# Altium project LASER_DRIVER_LN_HP.PrjPcb (part 3 of 4)

## Sheet Diagnostics.SchDoc: AI ARTIQ Driver
size 420 x 297 mm; Author: G.Kasprowicz; CompanyName: CTI; Organization: CTI; Address1: CTI; Address2: Nowowiejska 15/19 00-665 Warsaw; Address3: gkasprow@gmail.com; DocumentNumber: 6; Revision: 1.0; SheetNumber: 6; SheetTotal: 11; ModifiedBy: -; CheckedDate: -; Title2: protection; DivGrp: CTI; ModifiedDate: -; ProjectName: Sensor Box
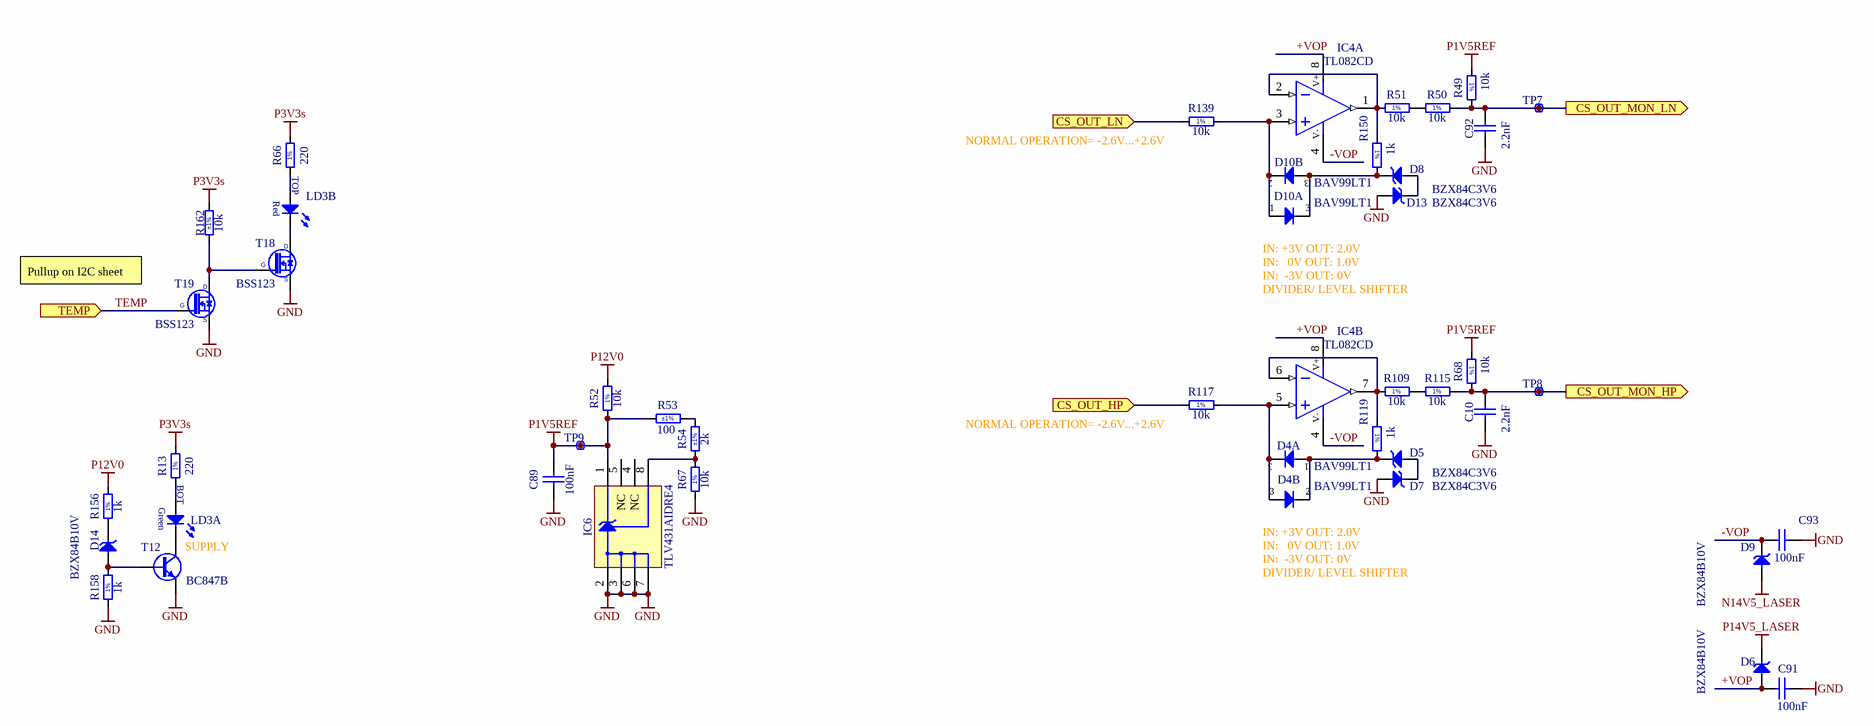
[diagram p6: Diagnostics.SchDoc]

### Parts
C10  2.2nF  [CAPC1608X87N]
C89  100nF  [CAPC1608X87N]
C91  100nF  [CAPC1608X87N]
C92  2.2nF  [CAPC1608X87N]
C93  100nF  [CAPC1608X87N]
D4  BAV99LT1  [SOT95P240X110-3N]  (parts A,B of 2)
D5  BZX84C3V6  [SOT95P240X130-3N]
D6  BZX84B10V  [SOT95P248X115-3N]
D7  BZX84C3V6  [SOT95P240X130-3N]
D8  BZX84C3V6  [SOT95P240X130-3N]
D9  BZX84B10V  [SOT95P248X115-3N]
D10  BAV99LT1  [SOT95P240X110-3N]  (parts A,B of 2)
D13  BZX84C3V6  [SOT95P240X130-3N]
D14  BZX84B10V  [SOT95P248X115-3N]
IC4  TL082CD  [SOIC127P600X175-8N]  (parts A,B of 2)
IC6  TLV431AIDRE4  [SOIC127P600X175-8N]
LD3  Red/Green  [LED_DIALIGHT_571-0112F]  (value not drawn)  (parts A,B of 2)
R13  220  [RESC1608X55N]
R49  10k  [RESC1608X55N]
R50  10k  [RESC1608X55N]
R51  10k  [RESC1608X55N]
R52  10k  [RESC1608X55N]
R53  100  Tolerance: ±1%  [RESC1608X55N]
R54  2k  Tolerance: ±1%  [RESC1608X55N]
R66  220  [RESC1608X55N]
R67  10k  [RESC1608X55N]
R68  10k  [RESC1608X55N]
R109  10k  [RESC1608X55N]
R115  10k  [RESC1608X55N]
R117  10k  [RESC1608X55N]
R119  1k  [RESC1608X55N]
R139  10k  [RESC1608X55N]
R150  1k  [RESC1608X55N]
R156  1k  [RESC1608X55N]
R158  1k  [RESC1608X55N]
R162  10k  Tolerance: ±1%  [RESC1005X40N]
T12  BC847B  [SOT95P230X110-3N]
T18  BSS123  [SOT95P240X130-3N]
T19  BSS123  [SOT95P240X130-3N]
TP7  Test Point  [TPS127]  (value not drawn)  (no BOM)
TP8  Test Point  [TPS127]  (value not drawn)  (no BOM)
TP9  Test Point  [TPS127]  (value not drawn)  (no BOM)

### Ports
CS_OUT_HP (in), CS_OUT_LN (in), CS_OUT_MON_HP (out), CS_OUT_MON_LN (out), TEMP (in)

### Nets
GND: C10.1 C89.1 C91.2 C92.1 C93.2 D7.1(A) D13.1(A) IC6.2(A) IC6.3(A) IC6.6(A) IC6.7(A) R67.1 R158.1 T12.2(E) T18.2(S) T19.2(S)
N14V5_LASER: D9.1(A)
P1V5REF: C89.2 IC6.1(C) R49.1 R52.1 R53.2 R68.1 TP9.1
P3V3s: R13.2 R66.2 R162.2
P12V0: R52.2 R156.2
P14V5_LASER: D6.3(C)
+VOP: C91.1 D6.1(A) IC4.8(V+)
-VOP: C93.1 D9.3(C) IC4.4(V-)
CS_OUT: R117.1 ; port CS_OUT_HP
CS_OUT: R139.1 ; port CS_OUT_LN  [a separate net that carries the same name]
JADC1_IN2_P: C92.2 R49.2 R50.2 TP7.1 ; port CS_OUT_MON_LN
JADC3_IN5_P: C10.2 R68.2 R115.2 TP8.1 ; port CS_OUT_MON_HP
TEMP: T19.1(G) ; port TEMP
NetD4_1: D4.1(A) D4.2(C) D5.3(C) R119.2
NetD4_3: D4.3(COMAC) IC4.5(IN+) R117.2
NetD5_1: D5.1(A) D7.3(C)
NetD8_1: D8.1(A) D13.3(C)
NetD8_3: D8.3(C) D10.3(COMAC) R150.2
NetD10_1: D10.1(A) D10.2(C) IC4.3(IN+) R139.2
NetD14_1: D14.1(A) R158.2 T12.1(B)
NetD14_3: D14.3(C) R156.1
NetIC4_1: IC4.1(OUT) IC4.2(IN-) R51.1 R150.1
NetIC4_6: IC4.6(IN-) IC4.7(OUT) R109.1 R119.1
NetIC6_8: IC6.8(REF) R54.1 R67.2
NetLD3_1: LD3.1(C) T12.3(C)
NetLD3_2: LD3.2(A) R13.1
NetLD3_3: LD3.3(C) T18.3(D)
NetLD3_4: LD3.4(A) R66.1
NetR50_1: R50.1 R51.2
NetR53_1: R53.1 R54.2
NetR109_2: R109.2 R115.1
NetR162_1: R162.1 T18.1(G) T19.3(D)

Not connected (* = marked no-connect by the designer): IC6 4(NC) 5(NC)

### Notes on the sheet
- (near R139) NORMAL OPERATION= -2.6V...+2.6V
- Pullup on I2C sheet
- IN:  -3V OUT: 0V
- (near D10) IN: +3V OUT: 2.0V
- IN:   0V OUT: 1.0V
- DIVIDER/ LEVEL SHIFTER
- (near R117) NORMAL OPERATION= -2.6V...+2.6V
- SUPPLY
- (near D4) IN: +3V OUT: 2.0V
- Project/Equipment
- Document
- Designer
- Drawn by
- Check.by
- Copyright 2018.
  This documentation describes Open Hardware and is licensed under the CERN OHL v.1.1. You may redistribute and modify this documentation under the terms of the CERN OHL v.1.1. (http://ohwr.org/CERNOHL). This documentation is distributed WITHOUT ANY EXPRESS OR IMPLIED WARRANTY, INCLUDING OF MERCHANTABILITY, SATISFACTORY QUALITY AND FITNESS FOR A PARTICULAR PURPOSE. Please see the CERN OHL v.1.1 for applicable conditions.
- Contact
- File
- Last Mod.
- Print Date
- Sheet
- Size
- A3
- of
- Rev
- (in symbol LED_DIALIGHT_571-0112F, part A) BOT; Green
- (in symbol LED_DIALIGHT_571-0112F, part B) TOP; Red
- (in symbol R0603_1K_1%_0.1W_100PPM) 1%
- (in symbol R0603_10K_1%_0.1W_100PPM) 1%
- (in symbol R0603_220R_1%_0.1W_100PPM) 1%

### Library data of the parts
C10 C92 = CC0603_2.2NF_50V_5%_C0G: Non-polarised capacitor; Part Description: SMD Multilayer Chip Ceramic Capacitor; Manufacturer: GENERIC; Manufacturer1 Part Number: C1608C0G1H222J080AA; Voltage: 50V; TC: C0G/NP0; Tolerance: ±5%; Part Number: CC0603_2.2NF_50V_5%_C0G; Component Kind: Standard; Component Type: Standard; Pin Count: 2; Value: 2.2nF; Status: Preferred; Manufacturer Part Number: CC0603_2.2NF_50V_5%_C0G; Case: 0603; Mounted: Yes; Socket: No; SMD: Yes; Sense: No; Manufacturer1 Example: TDK; Manufacturer1 ComponentHeight: 0.9mm; HelpURL: \\cern.ch\dfs\Applications\Altium\Datasheets\CC0603_C0G_TDK_C.pdf; Author: CERN DEM JMW; CreateDate: 23.06.2014; LatestRevisionDate: 23.06.2014
C89 C91 C93 = CC0603_100NF_50V_10%_X7R: Non-polarised capacitor; Part Description: SMD Multilayer Chip Ceramic Capacitor; Manufacturer: GENERIC; Manufacturer1 Part Number: 223858615649; Voltage: 50V; TC: X7R; Tolerance: ±10%; Part Number: CC0603_100NF_50V_10%_X7R; Component Kind: Standard; Component Type: Standard; Pin Count: 2; Value: 100nF; Status: Preferred; Manufacturer Part Number: CC0603_100NF_50V_10%_X7R; Case: 0603; Mounted: Yes; Socket: No; SMD: Yes; Sense: No; Manufacturer1 Example: PHYCOMP; Manufacturer1 ComponentHeight: 0.87mm; HelpURL: \\cern.ch\dfs\Applications\Altium\Datasheets\CC0603_X7R_PHYCOMP.pdf; Author: CERN DEM JLC; CreateDate: 03.12.2007; LatestRevisionDate: 03.12.2007
D4 D10 = BAV99LT1: Serial Diode; Part Description: Dual Series Switching Diode; Manufacturer: ON SEMICONDUCTOR; Voltage: 70V; Power: 225mW; PressFit: No; Bonding: No; Part Number: BAV99LT1; Component Kind: Standard; Component Type: Standard; Device: BAV99LT1; PackageDescription: SOT, 0.95mm Pitch; 3 Pin, 1.40mm W X 3.00mm L X 1.10mm H body, IPC Medium Density; Status: Obsolete; Manufacturer Part Number: BAV99LT1; Pin Count: 3; Case: SOT23-3; Mounted: Yes; Socket: No; SMD: Yes; Sense: No; ComponentHeight: 1.11mm; HelpURL: \\cern.ch\dfs\Applications\Altium\Datasheets\BAV99LT1.pdf; Author: CERN DEM JLC; CreateDate: 12.02.2009; LatestRevisionDate: 12.02.2009
D5 D7 D8 D13 = BZX84C3V6: Diode Zener Anode Pin 1 Cathode Pin 3 (Pas de pin 2); Part Description: Zener Diode; Manufacturer: FAIRCHILD SEMICONDUCTOR; Voltage: 3V6; Power: 350mW; PressFit: No; Bonding: No; Part Number: BZX84C3V6; Component Kind: Standard; Component Type: Standard; Device: BZX84C3V6; PackageDescription: SOT, 0.95mm Pitch; 3 Pin, 1.30mm W X 2.90mm L X 1.30mm H body, IPC Medium Density; Manufacturer Part Number: BZX84C3V6; Pin Count: 3; Case: SOT23-3; Mounted: Yes; Socket: No; SMD: Yes; Sense: No; ComponentHeight: 1.3mm; HelpURL: \\cern.ch\dfs\Applications\Altium\Datasheets\BZX84C3V6.pdf; Author: CERN DEM JLC; CreateDate: 06.10.2016; LatestRevisionDate: 06.10.2016
D6 D9 D14 = BZX84B10V: Diode Zener Anode Pin 1 Cathode Pin 3 (Pas de pin 2); Part Description: Small Signal Zener Diode; Manufacturer: VISHAY SEMICONDUCTORS; Voltage: 10V; Power: 300mW; PressFit: No; Bonding: No; Part Number: BZX84B10V; Component Kind: Standard; Component Type: Standard; Device: BZX84B10V; PackageDescription: SOT, 0.95mm Pitch; 3 Pin, 1.315mm W X 2.95mm L X 1.15mm H body, IPC Medium Density; Manufacturer Part Number: BZX84B10V; Pin Count: 2; Case: SOT23-3; Mounted: Yes; Socket: No; SMD: Yes; Sense: No; ComponentHeight: 1.15mm; HelpURL: \\cern.ch\dfs\Applications\Altium\Datasheets\BZX84B10V.pdf; Author: CERN DEM JLC; CreateDate: 23.10.2013; LatestRevisionDate: 23.10.2013
IC4 = TL082CD: Dual Operational Amplifier; Part Description: Dual JFET-Input Operational Amplifier; Manufacturer: TEXAS INSTRUMENTS; PressFit: No; Bonding: No; Part Number: TL082CD; Component Kind: Standard; Component Type: Standard; Device: TL082CD; PackageDescription: SOIC 8, Pitch 1.27mm - Body 4x5mm, IPC Medium Density; Manufacturer Part Number: TL082CD; Pin Count: 8; Case: SOIC8; Mounted: Yes; Socket: No; SMD: Yes; Sense: No; ComponentHeight: 1.75mm; Author: CERN DEM JLC; HelpURL: \\cern.ch\dfs\Applications\Altium\Datasheets\TL082CD.pdf; CreateDate: 20.05.2010; LatestRevisionDate: 20.05.2010
IC6 = TL431CD: Precision Programmable Reference; Part Description: Vref (1.25V) To 36V 2% Precision Programmable Reference; Manufacturer: TEXAS INSTRUMENTS; PressFit: No; Bonding: No; Part Number: TLV431AIDRE4; Component Kind: Standard; Component Type: Standard; Device: TLV431AIDRE4; PackageDescription: SOIC 8, Pitch 1.27mm, Body 4x5mm, IPC Medium Density; Manufacturer Part Number: TLV431AIDRE4; Pin Count: 8; Case: SOIC8; Mounted: Yes; Socket: No; SMD: Yes; Sense: No; ComponentHeight: 1.75mm; HelpURL: \\cern.ch\dfs\Applications\Altium\Datasheets\TL431CD.pdf; Author: CERN DEM JLC; CreateDate: 18.01.2011; LatestRevisionDate: 28.02.2011
LD3 = LED_DIALIGHT_571-0112F: 2x LED  Botom Green, Top Red; Part Description: Dual 2mm  LEDs, Red Top,Green Bot, CBI® Circuit Board Indicator (Without positioning pins); PressFit: No; Bonding: No; Part Number: LED_DIALIGHT_571-0112F; Component Kind: Standard; Component Type: Standard; Color: Red/Green; PackageDescription: 2x 2mm LED (Top: Red, Bot: Green) PCB Edge Mounting (Without positioning pins) DIALIGHT 571 Serie; Manufacturer: DIALIGHT; Manufacturer Part Number: 571-0112F; Pin Count: 4; Mounted: Yes; Socket: No; SMD: No; Sense: No; ComponentHeight: 8.6mm; HelpURL: \\cern.ch\dfs\Applications\Altium\Datasheets\LED_DIALIGHT_571-0112F.pdf; Author: CERN DEM JLC; CreateDate: 09/11/2009; LatestRevisionDate: 17/03/2010
R13 R66 = R0603_220R_1%_0.1W_100PPM: Resistor - 1%; Part Description: General Purpose Thick Film Chip Resistor; Manufacturer: GENERIC; Manufacturer1 Part Number: NRC06F2200TRF; Power: 0.1W; TC: ±100ppm/°C; Part Number: R0603_220R_1%_0.1W_100PPM; Component Kind: Standard; Component Type: Standard; Pin Count: 2; Value: 220; Status: Preferred; Tolerance: ±1%; Manufacturer Part Number: R0603_220R_1%_0.1W_100PPM; Case: 0603; Mounted: Yes; Sense: No; Socket: No; SMD: Yes; Manufacturer1 Example: NIC COMPONENT; Manufacturer1 ComponentHeight: 0.55mm; HelpURL: \\cern.ch\dfs\Applications\Altium\Datasheets\R0603_NIC_NRC.pdf; Author: CERN DEM JLC; CreateDate: 03.12.2007; LatestRevisionDate: 13.03.2008
R49-R52 R67 R68 R109 R115 R117 R139 = R0603_10K_1%_0.1W_100PPM: Resistor - 1%; Part Description: General Purpose Thick Film Chip Resistor; Manufacturer: GENERIC; Manufacturer1 Part Number: NRC06F1002TRF; Power: 0.1W; TC: ±100ppm/°C; PressFit: No; Part Number: R0603_10K_1%_0.1W_100PPM; Component Kind: Standard; Component Type: Standard; Pin Count: 2; Value: 10k; Status: Preferred; Tolerance: ±1%; Manufacturer Part Number: R0603_10K_1%_0.1W_100PPM; Case: 0603; Mounted: Yes; Sense: No; Socket: No; SMD: Yes; Manufacturer1 Example: NIC COMPONENT; Manufacturer1 ComponentHeight: 0.55mm; HelpURL: \\cern.ch\dfs\Applications\Altium\Datasheets\R0603_NIC_NRC.pdf; Author: CERN DEM JLC; CreateDate: 03.12.2007; LatestRevisionDate: 13.03.2008
R53 = R0603_100R_1%_0.1W_100PPM: Resistor - 1%; Part Description: General Purpose Thick Film Chip Resistor; Manufacturer: GENERIC; Manufacturer1 Part Number: NRC06F4700TRF; Power: 0.1W; TC: ±100ppm/°C; PressFit: No; Part Number: R0603_100R_1%_0.1W_100PPM; Component Kind: Standard; Component Type: Standard; Pin Count: 2; Value: 100; Status: Preferred; Manufacturer Part Number: R0603_100R_1%_0.1W_100PPM; Case: 0603; Mounted: Yes; Sense: No; Socket: No; SMD: Yes; Manufacturer1 Example: NIC COMPONENT; Manufacturer1 ComponentHeight: 0.55mm; HelpURL: \\cern.ch\dfs\Applications\Altium\Datasheets\R0603_NIC_NRC.pdf; Author: CERN DEM JLC; CreateDate: 03.12.2007; LatestRevisionDate: 13.03.2008
R54 = R0603_2K_1%_0.1W_100PPM: Resistor - 1%; Part Description: General Purpose Thick Film Chip Resistor; Manufacturer: GENERIC; Manufacturer1 Part Number: NRC06F2001TRF; Power: 0.1W; TC: ±100ppm/°C; PressFit: No; Part Number: R0603_2K_1%_0.1W_100PPM; Component Kind: Standard; Component Type: Standard; Pin Count: 2; Value: 2k; Status: Preferred; Manufacturer Part Number: R0603_2K_1%_0.1W_100PPM; Case: 0603; Mounted: Yes; Sense: No; Socket: No; SMD: Yes; Manufacturer1 Example: NIC COMPONENT; Manufacturer1 ComponentHeight: 0.55mm; HelpURL: \\cern.ch\dfs\Applications\Altium\Datasheets\R0603_NIC_NRC.pdf; Author: CERN DEM JLC; CreateDate: 03.12.2007; LatestRevisionDate: 13.03.2008
R119 R150 R156 R158 = R0603_1K_1%_0.1W_100PPM: Resistor - 1%; Part Description: General Purpose Thick Film Chip Resistor; Manufacturer: GENERIC; Manufacturer1 Part Number: NRC06F1001TRF; Power: 0.1W; TC: ±100ppm/°C; PressFit: No; Part Number: R0603_1K_1%_0.1W_100PPM; Component Kind: Standard; Component Type: Standard; Pin Count: 2; Value: 1k; Status: Preferred; Tolerance: ±1%; Manufacturer Part Number: R0603_1K_1%_0.1W_100PPM; Case: 0603; Mounted: Yes; Sense: No; Socket: No; SMD: Yes; Manufacturer1 Example: NIC COMPONENT; Manufacturer1 ComponentHeight: 0.55mm; HelpURL: \\cern.ch\dfs\Applications\Altium\Datasheets\R0603_NIC_NRC.pdf; Author: CERN DEM JLC; CreateDate: 03.12.2007; LatestRevisionDate: 13.03.2008
R162 = R0402_10K_1%_0.0625W_100PPM: Resistor - 1%; Part Description: General Purpose Thick Film Chip Resistor; Manufacturer: GENERIC; Manufacturer1 Part Number: 232270671003L; TC: ±100ppm/°C; PressFit: No; Part Number: R0402_10K_1%_0.0625W_100PPM; Component Kind: Standard; Component Type: Standard; Pin Count: 2; Value: 10k; Status: Not Recommended; Power: 0.0625W; Manufacturer Part Number: R0402_10K_1%_0.0625W_100PPM; Case: 0402; Mounted: Yes; Sense: No; Socket: No; SMD: Yes; Manufacturer1 Example: YAGEO PHYCOMP; Manufacturer1 ComponentHeight: 0.4mm; HelpURL: \\cern.ch\dfs\Applications\Altium\Datasheets\R0402_Phycomp_RC0402.pdf; Author: CERN DEM JLC; CreateDate: 03.12.2007; LatestRevisionDate: 17.10.2012
T12 = BC847B: NPN Transistor; Part Description: 45V 100mA NPN general-purpose transistors; Manufacturer: NXP SEMICONDUCTORS; PressFit: No; Bonding: No; Part Number: BC847B; Component Kind: Standard; Component Type: Standard; Device: BC847B; PackageDescription: SOT23, 0.95mm Pitch; 3 Pin, 1.30mm W X 2.90mm L X 1.10mm H body, IPC Medium Density; Manufacturer Part Number: BC847B; Pin Count: 3; Case: SOT23-3; Mounted: Yes; Socket: No; SMD: Yes; Sense: No; ComponentHeight: 1.1mm; HelpURL: \\cern.ch\dfs\Applications\Altium\Datasheets\BC847B.pdf; Author: CERN DEM JLC; CreateDate: 14.06.2011; LatestRevisionDate: 14.06.2011
T18 T19 = BSS123: N-CHANNEL MOSFET WITH DIODE; Part Description: 100V 170mA N-Channel Logic Level Enhancement Mode Field Effect Transistor (FET); Manufacturer: FAIRCHILD SEMICONDUCTOR; PressFit: No; Bonding: No; Part Number: BSS123; Component Kind: Standard; Component Type: Standard; Device: BSS123; PackageDescription: SOT23, 0.95mm Pitch; 3 Pin, 1.30mm W X 2.90mm L X 1.30mm H body, IPC Medium Density; Manufacturer Part Number: BSS123; Pin Count: 3; Case: SOT23-3; Mounted: Yes; Socket: No; SMD: Yes; Sense: No; ComponentHeight: 1.3mm; HelpURL: \\cern.ch\dfs\Applications\Altium\Datasheets\BSS123.pdf; Author: CERN DEM JLC; CreateDate: 07.04.2009; LatestRevisionDate: 07.04.2009
TP7-TP9 = SMD_PAD_1.27X1.27MM: Part Description: 1.27mm x 1.27mm PCB Copper Area (SMD Test Point); Mounted: No; Part Number: SMD_PAD_1.27X1.27MM; Component Type: Standard (No BOM); Pin Count: 1; Family: Test Point; Socket: No; SMD: No; Sense: No; Status: None; ComponentHeight: 0mm; HelpURL: Undefined; Author: CERN DEM JLC; CreateDate: 12.01.2008; LatestRevisionDate: 12.01.2008; PackageDescription: 1.27mm x 1.27mm PCB Copper Area (SMD Test Point)

## Sheet LN_LASER_PS.SchDoc: AI ARTIQ Driver
size 420 x 297 mm; Author: G.Kasprowicz; CompanyName: CTI; Organization: CTI; Address1: CTI; Address2: Nowowiejska 15/19 00-665 Warsaw; Address3: gkasprow@gmail.com; DocumentNumber: 9; Revision: 1.0; SheetNumber: 9; SheetTotal: 11; ModifiedBy: -; CheckedDate: -; Title2: LN LASER PS; DivGrp: CTI; ModifiedDate: -; ProjectName: Sensor Box
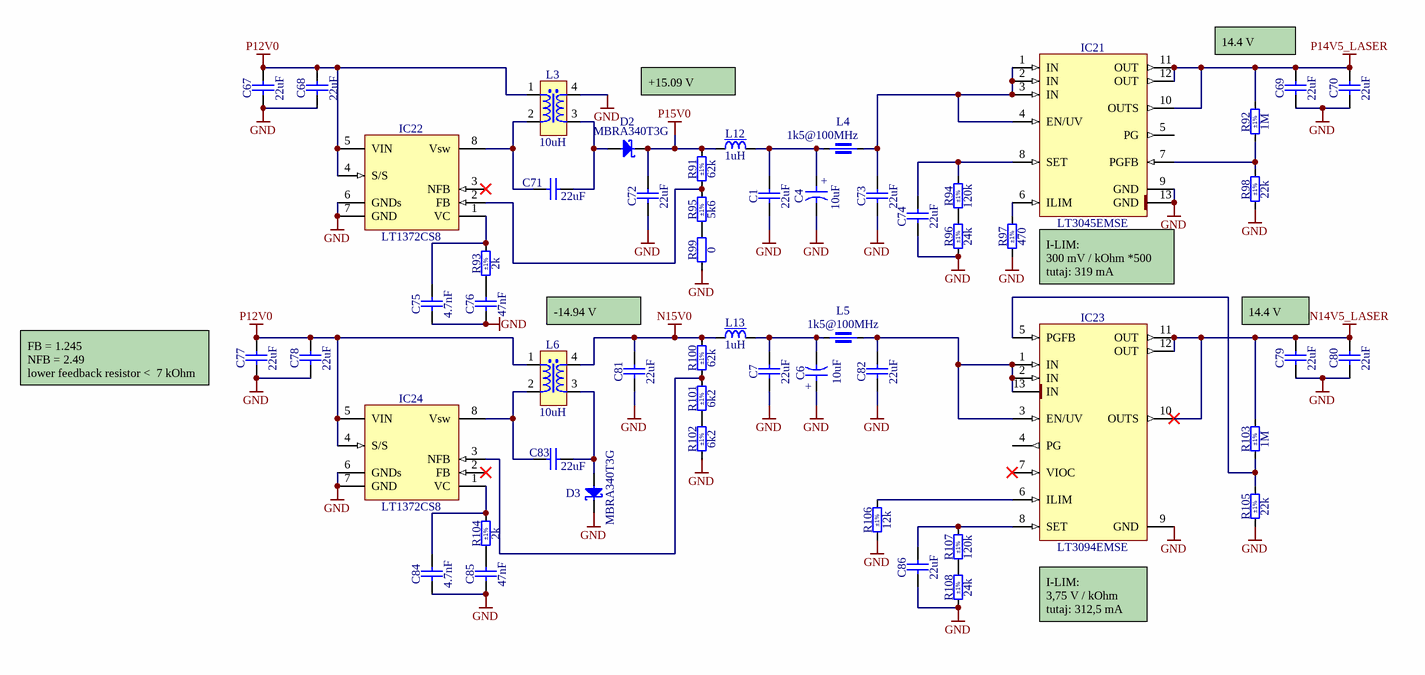
[diagram p7: LN_LASER_PS.SchDoc]

### Parts
C1  22uF  [CAPC3216X180N]
C4  10uF  [CAPMP3528X210N]
C6  10uF  [CAPMP3528X210N]
C7  22uF  [CAPC3216X180N]
C67  22uF  [CAPC3216X180N]
C68  22uF  [CAPC3216X180N]
C69  22uF  [CAPC3216X180N]
C70  22uF  [CAPC3216X180N]
C71  22uF  [CAPC3216X180N]
C72  22uF  [CAPC3216X180N]
C73  22uF  [CAPC3216X180N]
C74  22uF  [CAPC3216X180N]
C75  4.7nF  [CAPC1005X55N]
C76  47nF  [CAPC1005X55N]
C77  22uF  [CAPC3216X180N]
C78  22uF  [CAPC3216X180N]
C79  22uF  [CAPC3216X180N]
C80  22uF  [CAPC3216X180N]
C81  22uF  [CAPC3216X180N]
C82  22uF  [CAPC3216X180N]
C83  22uF  [CAPC3216X180N]
C84  4.7nF  [CAPC1005X55N]
C85  47nF  [CAPC1005X55N]
C86  22uF  [CAPC3216X180N]
D2  MBRA340T3G  [DIOM5226X220N]
D3  MBRA340T3G  [DIOM5226X220N]
IC21  LT3045EMSE  [SOP65P490X110-13N-R175X294]
IC22  LT1372CS8  [SOIC127P600X175-8N]
IC23  LT3094EMSE  [SOP65P490X110-13N-R175X294]
IC24  LT1372CS8  [SOIC127P600X175-8N]
L3  10uH  [IND_COOPER_CTX-1A]
L4  1k5@100MHz  [INDC2012X110N]
L5  1k5@100MHz  [INDC2012X110N]
L6  10uH  [IND_COOPER_CTX-1A]
L12  1uH  [INDM3225X210N]
L13  1uH  [INDM3225X210N]
R91  62k  Tolerance: ±1%  [RESC1005X40N]
R92  1M  Tolerance: ±1%  [RESC1005X40N]
R93  2k  Tolerance: ±1%  [RESC1005X40N]
R94  120k  Tolerance: ±1%  [RESC1608X55N]
R95  5k6  Tolerance: ±1%  [RESC1005X40N]
R96  24k  Tolerance: ±1%  [RESC1608X55N]
R97  470  Tolerance: ±1%  [RESC1005X40N]
R98  22k  Tolerance: ±1%  [RESC1005X40N]
R99  0  [RESC1005X40N]
R100  62k  Tolerance: ±1%  [RESC1005X40N]
R101  6k2  Tolerance: ±1%  [RESC1005X40N]
R102  6k2  Tolerance: ±1%  [RESC1005X40N]
R103  1M  Tolerance: ±1%  [RESC1005X40N]
R104  2k  Tolerance: ±1%  [RESC1005X40N]
R105  22k  Tolerance: ±1%  [RESC1005X40N]
R106  12k  Tolerance: ±1%  [RESC1005X40N]
R107  120k  Tolerance: ±1%  [RESC1608X55N]
R108  24k  Tolerance: ±1%  [RESC1608X55N]

### Nets
GND: C1.1 C4.2 C6.1 C7.1 C67.1 C68.1 C69.1 C70.1 C72.1 C73.1 C74.1 C75.1 C76.1 C77.1 C78.1 C79.1 C80.1 C81.1 C82.1 C84.1 C85.1 C86.1 D3.1(C) IC21.9(GND) IC21.13(GND) IC22.6(GNDs) IC22.7(GND) IC23.9(GND) IC24.6(GNDs) IC24.7(GND) L3.4 R96.1 R97.1 R98.1 R99.1 R102.1 R105.1 R106.1 R108.1
N14V5_LASER: C79.2 C80.2 IC23.10(OUTS) IC23.11(OUT) IC23.12(OUT) R103.2
N15V0: C81.2 L6.4 L13.1 R100.2
P12V0: C67.2 C68.2 C77.2 C78.2 IC22.4(S/S) IC22.5(VIN) IC24.4(S/S) IC24.5(VIN) L3.1 L6.1
P14V5_LASER: C69.2 C70.2 IC21.10(OUTS) IC21.11(OUT) IC21.12(OUT) R92.2
P15V0: C72.2 D2.1(C) L12.1 R91.2
NetC1_2: C1.2 C4.1 L4.1 L12.2
NetC6_2: C6.2 C7.2 L5.1 L13.2
NetC71_1: C71.1 D2.2(A) L3.3
NetC71_2: C71.2 IC22.8(Vsw) L3.2
NetC73_2: C73.2 IC21.1(IN) IC21.2(IN) IC21.3(IN) IC21.4(EN/UV) L4.2
NetC74_2: C74.2 IC21.8(SET) R94.2
NetC75_2: C75.2 IC22.1(VC) R93.2
NetC76_2: C76.2 R93.1
NetC82_2: C82.2 IC23.1(IN) IC23.2(IN) IC23.3(EN/UV) IC23.13(IN) L5.2
NetC83_1: C83.1 D3.2(A) L6.3
NetC83_2: C83.2 IC24.8(Vsw) L6.2
NetC84_2: C84.2 IC24.1(VC) R104.2
NetC85_2: C85.2 R104.1
NetC86_2: C86.2 IC23.8(SET) R107.2
NetIC21_6: IC21.6(ILIM) R97.2
NetIC21_7: IC21.7(PGFB) R92.1 R98.2
NetIC22_2: IC22.2(FB) R91.1 R95.2
NetIC23_5: IC23.5(PGFB) R103.1 R105.2
NetIC23_6: IC23.6(ILIM) R106.2
NetIC24_3: IC24.3(NFB) R100.1 R101.2
NetR94_1: R94.1 R96.2
NetR95_1: R95.1 R99.2
NetR101_1: R101.1 R102.2
NetR107_1: R107.1 R108.2

Not connected (* = marked no-connect by the designer): IC21 5(PG); IC22 3(NFB)*; IC23 4(PG) 7(VIOC)*; IC24 2(FB)*

### Notes on the sheet
- +15.09 V
- (near C69) 14.4 V
- I-LIM:
  300 mV / kOhm *500
  tutaj: 319 mA
- -14.94 V
- (near C79) 14.4 V
- (near C77) FB = 1.245
  NFB = 2.49
  lower feedback resistor <  7 kOhm
- (near IC23) I-LIM:
  3,75 V / kOhm
  tutaj: 312,5 mA
- Project/Equipment
- Document
- Designer
- Drawn by
- Check.by
- Copyright 2018.
  This documentation describes Open Hardware and is licensed under the CERN OHL v.1.1. You may redistribute and modify this documentation under the terms of the CERN OHL v.1.1. (http://ohwr.org/CERNOHL). This documentation is distributed WITHOUT ANY EXPRESS OR IMPLIED WARRANTY, INCLUDING OF MERCHANTABILITY, SATISFACTORY QUALITY AND FITNESS FOR A PARTICULAR PURPOSE. Please see the CERN OHL v.1.1 for applicable conditions.
- Contact
- File
- Last Mod.
- Print Date
- Sheet
- Size
- A3
- of
- Rev
- (in symbol CTE3528-21_10UF_20V_10%_AVX_TPSB106K020T0500) +

### Library data of the parts
C1 C7 C67-C74 C77-C83 C86 = CC1206_22UF_35V_20%_JB_TDK_C3216JB1V226M160AC: Non-polarised capacitor; Part Description: SMD Multilayer Chip Ceramic Capacitor; Manufacturer: TDK; Voltage: 35V; TC: JB(±10%); Tolerance: ±20%; Part Number: CC1206_22UF_35V_20%_JB_TDK_C3216JB1V226M160AC; Component Kind: Standard; Component Type: Standard; Pin Count: 2; Value: 22uF; Status: None; Manufacturer Part Number: C3216JB1V226M160AC; Case: 1206; Mounted: Yes; Socket: No; SMD: Yes; Sense: No; ComponentHeight: 1.8mm; HelpURL: \\cern.ch\dfs\Applications\Altium\Datasheets\CC1206_TDK_C3216JB1V226M160AC.pdf; Author: CERN DEM JLC; CreateDate: 13.07.2017; LatestRevisionDate: 13.07.2017
C4 C6 = CTE3528-21_10UF_20V_10%_AVX_TPSB106K020T0500: Polarised capacitor; Part Description: Low ESR 0R5 Automotive Solid Tantalum Chip Capacitor; Manufacturer: AVX; Voltage: 20V; Tolerance: ±10%; Part Number: CTE3528-21_10UF_20V_10%_AVX_TPSB106K020T0500; Component Kind: Standard; Component Type: Standard; Pin Count: 2; Value: 10uF; Status: Not Recommended; Manufacturer Part Number: TPSB106K020T0500; Case: B; Mounted: Yes; Socket: No; SMD: Yes; Sense: No; ComponentHeight: 2.1mm; HelpURL: \\cern.ch\dfs\Applications\Altium\Datasheets\CTE-LESR_AVX_TPS-AUTO.pdf; Author: CERN DEM JLC; CreateDate: 10.05.2017; LatestRevisionDate: 10.05.2017
C75 C84 = CC0402_4.7NF_16V_10%_X7R: Non-polarised capacitor; Part Description: SMD Multilayer Chip Ceramic Capacitor; Manufacturer: GENERIC; Manufacturer1 Part Number: 223878715632; Voltage: 16V; TC: X7R; Tolerance: ±10%; Part Number: CC0402_4.7NF_16V_10%_X7R; Component Kind: Standard; Component Type: Standard; Pin Count: 2; Value: 4.7nF; Status: Not Recommended; Manufacturer Part Number: CC0402_4.7NF_16V_10%_X7R; Case: 0402; Mounted: Yes; Socket: No; SMD: Yes; Sense: No; Manufacturer1 Example: PHYCOMP; Manufacturer1 ComponentHeight: 0.55mm; HelpURL: \\cern.ch\dfs\Applications\Altium\Datasheets\CC0402_X7R_PHYCOMP.pdf; Author: CERN DEM JLC; CreateDate: 03.12.2007; LatestRevisionDate: 03.12.2007
C76 C85 = CC0402_47NF_25V_10%_X7R: Non-polarised capacitor; Part Description: SMD Multilayer Chip Ceramic Capacitor; Manufacturer: GENERIC; Manufacturer1 Part Number: C1005X7R1E473K050; Voltage: 25V; TC: X7R; Tolerance: ±10%; Part Number: CC0402_47NF_25V_10%_X7R; Component Kind: Standard; Component Type: Standard; Pin Count: 2; Value: 47nF; Status: Preferred; Manufacturer Part Number: CC0402_47NF_25V_10%_X7R; Case: 0402; Mounted: Yes; Socket: No; SMD: Yes; Sense: No; Manufacturer1 Example: TDK; Manufacturer1 ComponentHeight: 0.55mm; HelpURL: \\cern.ch\dfs\Applications\Altium\Datasheets\CC0402_X7R_TDK_C.pdf; Author: CERN DEM JLC; CreateDate: 25.10.2012; LatestRevisionDate: 25.10.2012
D2 D3 = MBRA340T3G: Schottky Diode; Part Description: Schottky Power Rectifier; Manufacturer: ON SEMICONDUCTOR; Voltage: 40V; Power: 3A; PressFit: No; Bonding: No; Part Number: MBRA340T3G; Component Kind: Standard; Component Type: Standard; Device: MBRA340T3G; PackageDescription: DO-214-AC/SMA Diode, Molded Body; 5.21mm L X 2.60mm W X 2.20mm H, IPC Medium Density; Manufacturer Part Number: MBRA340T3G; Pin Count: 2; Case: DO-214AC; Mounted: Yes; Socket: No; SMD: Yes; Sense: No; ComponentHeight: 2.20mm; HelpURL: \\cern.ch\dfs\Applications\Altium\Datasheets\MBRA340T3G.pdf; Author: CERN DEM JLC; CreateDate: 18.06.2012; LatestRevisionDate: 18.06.2012
IC21 = LT3045EMSE: 20V, 500mA, Ultralow Noise, Ultrahigh PSRR Linear Regulator; Manufacturer: LINEAR TECHNOLOGY; PressFit: No; Bonding: No; Part Number: LT3045EMSE; Component Kind: Standard; Component Type: Standard; Device: LT3045EMSE; PackageDescription: SOP, 0.65mm Pitch; 12 Pin, 3.00mm W X 4.039mm L X 1.10mm H body (w/Thermal Tab 1.75 X 2.94 mm), IPC Medium Density; Part Description: 20V, 500mA, Ultralow Noise, Ultrahigh PSRR Linear Regulator; Manufacturer Part Number: LT3045EMSE; Pin Count: 13; Case: MSOP12; Mounted: Yes; Socket: No; SMD: Yes; Sense: No; ComponentHeight: 1.1mm; HelpURL: \\cern.ch\dfs\Applications\Altium\Datasheets\LT3045.pdf; Author: CERN DEM HF; CreateDate: 18.05.2022; LatestRevisionDate: 18.05.2022
IC22 IC24 = LT1372CS8: 500kHz, 1.5A, High Efficiency, 1.5A Switching Regulators; Manufacturer: LINEAR TECHNOLOGY; PressFit: No; Bonding: No; Part Number: LT1372CS8; Component Kind: Standard; Component Type: Standard; Device: LT1372CS8; PackageDescription: SOIC 8, Pitch 1.27mm, Body 4x5mm, IPC Medium Density; Part Description: 500kHz, 1.5A,  High Efficiency, 1.5A Switching Regulators; Manufacturer Part Number: LT1372CS8; Pin Count: 8; Case: SOIC8; Mounted: Yes; Socket: No; SMD: Yes; Sense: No; ComponentHeight: 1.75mm; HelpURL: \\cern.ch\dfs\Applications\Altium\Datasheets\LT1372.pdf; Author: CERN DEM HF; CreateDate: 18.05.2022; LatestRevisionDate: 18.05.2022
IC23 = LT3094EMSE#PBF: -20V, 500mA, Ultralow Noise, Ultrahigh PSRR Negative Linear Regulator; Manufacturer: LINEAR TECHNOLOGY; PressFit: No; Bonding: No; Part Number: LT3094EMSE#PBF; Component Kind: Standard; Component Type: Standard; Device: LT3094EMSE; PackageDescription: SOP, 0.65mm Pitch; 12 Pin, 3.00mm W X 4.039mm L X 1.10mm H body (w/Thermal Tab 1.75 X 2.94 mm), IPC Medium Density; Part Description: -20V, 500mA, Ultralow Noise, Ultrahigh PSRR Negative Linear Regulator; Manufacturer Part Number: LT3094EMSE#PBF; Pin Count: 13; Case: MSOP12; Mounted: Yes; Socket: No; SMD: Yes; Sense: No; ComponentHeight: 1.1mm; HelpURL: \\cern.ch\dfs\Applications\Altium\Datasheets\LT3094EMSE#PBF.pdf; Author: CERN DEM JLC; CreateDate: 12.11.2018; LatestRevisionDate: 12.11.2018
L3 L6 = IND_COOPER_CTX10-1A-R: Dual Winding Shielded Power Inductor/Transformer CTX OCTA-PAC® PLUS Serie; Part Description: Dual Winding Shielded Power Inductor/Transformer CTX OCTA-PAC® PLUS Series; Manufacturer: COOPER BUSSMANN; Tolerance: ±25%; Part Number: IND_COOPER_CTX10-1A-R; Component Kind: Standard; Component Type: Standard; Pin Count: 2; Value: 10uH; Manufacturer Part Number: CTX10-1A-R; Mounted: Yes; Socket: No; SMD: Yes; Sense: No; ComponentHeight: 4.19mm; HelpURL: \\cern.ch\dfs\Applications\Altium\Datasheets\IND_COOPER_CTX.pdf; Author: CERN DEM JLC; CreateDate: 10.08.2010; LatestRevisionDate: 10.08.2010
L4 L5 = IND0805_WURTH_742792097: Part Description: SMD EMI Suppression Chip Ferrite Bead (WE-CBF Series); Manufacturer: WURTH ELEKTRONIK; Power: 1A; Resistance: 0.3R; Tolerance: ±25%; Part Number: IND0805_WURTH_742792097; Component Kind: Standard; Component Type: Standard; Pin Count: 2; Value: 1k5@100MHz; Manufacturer Part Number: 742792097; Case: 0805; Mounted: Yes; Socket: No; SMD: Yes; Sense: No; ComponentHeight: 1.1mm; HelpURL: \\cern.ch\dfs\Applications\Altium\Datasheets\IND0805_WURTH_742792097.pdf; Author: CERN DEM MR; CreateDate: 29.06.2017; LatestRevisionDate: 25.10.2018
L12 L13 = IND1210_1UH_10%_EPCOS_B82422A: Inductor With Core; Part Description: SMT Inductor SIMID Series; Manufacturer: EPCOS; Manufacturer Part Number: B82422A1102K100; Power: 380mA; Resistance: 0.34R; Tolerance: ±10%; Part Number: IND1210_1UH_10%_EPCOS_B82422A; Component Kind: Standard; Component Type: Standard; Pin Count: 2; Value: 1uH; Status: None; Case: 1210; Mounted: Yes; Socket: No; SMD: Yes; Sense: No; ComponentHeight: 2.1mm; HelpURL: \\cern.ch\dfs\Applications\Altium\Datasheets\IND1210_EPCOS_B82422A.pdf; Author: CERN DEM JLC; CreateDate: 30.11.2011; LatestRevisionDate: 30.11.2011
R91 R100 = R0402_62K_1%_0.0625W_100PPM: Resistor - 1%; Part Description: General Purpose Thick Film Chip Resistor; Manufacturer: GENERIC; Manufacturer1 Part Number: 232270676203L; TC: ±100ppm/°C; PressFit: No; Part Number: R0402_62K_1%_0.0625W_100PPM; Component Kind: Standard; Component Type: Standard; Pin Count: 2; Value: 62k; Status: Not Recommended; Power: 0.0625W; Manufacturer Part Number: R0402_62K_1%_0.0625W_100PPM; Case: 0402; Mounted: Yes; Sense: No; Socket: No; SMD: Yes; Manufacturer1 Example: YAGEO PHYCOMP; Manufacturer1 ComponentHeight: 0.4mm; HelpURL: \\cern.ch\dfs\Applications\Altium\Datasheets\R0402_Phycomp_RC0402.pdf; Author: CERN DEM JLC; CreateDate: 03.12.2007; LatestRevisionDate: 17.10.2012
R92 R103 = R0402_1M_1%_0.0625W_100PPM: Resistor - 1%; Part Description: General Purpose Thick Film Chip Resistor; Manufacturer: GENERIC; Manufacturer1 Part Number: 232270671005L; TC: ±100ppm/°C; PressFit: No; Part Number: R0402_1M_1%_0.0625W_100PPM; Component Kind: Standard; Component Type: Standard; Pin Count: 2; Value: 1M; Status: Not Recommended; Power: 0.0625W; Manufacturer Part Number: R0402_1M_1%_0.0625W_100PPM; Case: 0402; Mounted: Yes; Sense: No; Socket: No; SMD: Yes; Manufacturer1 Example: YAGEO PHYCOMP; Manufacturer1 ComponentHeight: 0.4mm; HelpURL: \\cern.ch\dfs\Applications\Altium\Datasheets\R0402_Phycomp_RC0402.pdf; Author: CERN DEM JLC; CreateDate: 03.12.2007; LatestRevisionDate: 17.10.2012
R93 R104 = R0402_2K_1%_0.0625W_100PPM: Resistor - 1%; Part Description: General Purpose Thick Film Chip Resistor; Manufacturer: GENERIC; Manufacturer1 Part Number: 232270672002L; TC: ±100ppm/°C; PressFit: No; Part Number: R0402_2K_1%_0.0625W_100PPM; Component Kind: Standard; Component Type: Standard; Pin Count: 2; Value: 2k; Status: Not Recommended; Power: 0.0625W; Manufacturer Part Number: R0402_2K_1%_0.0625W_100PPM; Case: 0402; Mounted: Yes; Sense: No; Socket: No; SMD: Yes; Manufacturer1 Example: YAGEO PHYCOMP; Manufacturer1 ComponentHeight: 0.4mm; HelpURL: \\cern.ch\dfs\Applications\Altium\Datasheets\R0402_Phycomp_RC0402.pdf; Author: CERN DEM JLC; CreateDate: 03.12.2007; LatestRevisionDate: 17.10.2012
R94 R107 = R0603_120K_1%_0.1W_100PPM: Resistor - 1%; Part Description: General Purpose Thick Film Chip Resistor; Manufacturer: GENERIC; Manufacturer1 Part Number: NRC06F1203TRF; Power: 0.1W; TC: ±100ppm/°C; PressFit: No; Part Number: R0603_120K_1%_0.1W_100PPM; Component Kind: Standard; Component Type: Standard; Pin Count: 2; Value: 120k; Status: Preferred; Manufacturer Part Number: R0603_120K_1%_0.1W_100PPM; Case: 0603; Mounted: Yes; Sense: No; Socket: No; SMD: Yes; Manufacturer1 Example: NIC COMPONENT; Manufacturer1 ComponentHeight: 0.55mm; HelpURL: \\cern.ch\dfs\Applications\Altium\Datasheets\R0603_NIC_NRC.pdf; Author: CERN DEM JLC; CreateDate: 03.12.2007; LatestRevisionDate: 13.03.2008
R95 = R0402_5K6_1%_0.0625W_100PPM: Resistor - 1%; Part Description: General Purpose Thick Film Chip Resistor; Manufacturer: GENERIC; Manufacturer1 Part Number: 232270675602L; TC: ±100ppm/°C; PressFit: No; Part Number: R0402_5K6_1%_0.0625W_100PPM; Component Kind: Standard; Component Type: Standard; Pin Count: 2; Value: 5k6; Status: Not Recommended; Power: 0.0625W; Manufacturer Part Number: R0402_5K6_1%_0.0625W_100PPM; Case: 0402; Mounted: Yes; Sense: No; Socket: No; SMD: Yes; Manufacturer1 Example: YAGEO PHYCOMP; Manufacturer1 ComponentHeight: 0.4mm; HelpURL: \\cern.ch\dfs\Applications\Altium\Datasheets\R0402_Phycomp_RC0402.pdf; Author: CERN DEM JLC; CreateDate: 03.12.2007; LatestRevisionDate: 17.10.2012
R96 R108 = R0603_24K_1%_0.1W_100PPM: Resistor - 1%; Part Description: General Purpose Thick Film Chip Resistor; Manufacturer: GENERIC; Manufacturer1 Part Number: NRC06F2402TRF; Power: 0.1W; TC: ±100ppm/°C; PressFit: No; Part Number: R0603_24K_1%_0.1W_100PPM; Component Kind: Standard; Component Type: Standard; Pin Count: 2; Value: 24k; Status: Preferred; Manufacturer Part Number: R0603_24K_1%_0.1W_100PPM; Case: 0603; Mounted: Yes; Sense: No; Socket: No; SMD: Yes; Manufacturer1 Example: NIC COMPONENT; Manufacturer1 ComponentHeight: 0.55mm; HelpURL: \\cern.ch\dfs\Applications\Altium\Datasheets\R0603_NIC_NRC.pdf; Author: CERN DEM JLC; CreateDate: 03.12.2007; LatestRevisionDate: 13.03.2008
R97 = R0402_470R_1%_0.0625W_100PPM: Resistor - 1%; Part Description: General Purpose Thick Film Chip Resistor; Manufacturer: GENERIC; Manufacturer1 Part Number: 232270674701L; TC: ±100ppm/°C; PressFit: No; Part Number: R0402_470R_1%_0.0625W_100PPM; Component Kind: Standard; Component Type: Standard; Pin Count: 2; Value: 470; Status: Not Recommended; Power: 0.0625W; Manufacturer Part Number: R0402_470R_1%_0.0625W_100PPM; Case: 0402; Mounted: Yes; Sense: No; Socket: No; SMD: Yes; Manufacturer1 Example: YAGEO PHYCOMP; Manufacturer1 ComponentHeight: 0.4mm; HelpURL: \\cern.ch\dfs\Applications\Altium\Datasheets\R0402_Phycomp_RC0402.pdf; Author: CERN DEM JLC; CreateDate: 03.12.2007; LatestRevisionDate: 17.10.2012
R98 R105 = R0402_22K_1%_0.0625W_100PPM: Resistor - 1%; Part Description: General Purpose Thick Film Chip Resistor; Manufacturer: GENERIC; Manufacturer1 Part Number: 232270672203L; TC: ±100ppm/°C; PressFit: No; Part Number: R0402_22K_1%_0.0625W_100PPM; Component Kind: Standard; Component Type: Standard; Pin Count: 2; Value: 22k; Status: Not Recommended; Power: 0.0625W; Manufacturer Part Number: R0402_22K_1%_0.0625W_100PPM; Case: 0402; Mounted: Yes; Sense: No; Socket: No; SMD: Yes; Manufacturer1 Example: YAGEO PHYCOMP; Manufacturer1 ComponentHeight: 0.4mm; HelpURL: \\cern.ch\dfs\Applications\Altium\Datasheets\R0402_Phycomp_RC0402.pdf; Author: CERN DEM JLC; CreateDate: 03.12.2007; LatestRevisionDate: 17.10.2012
R99 = R0402_0R_JUMPER: Resistor; Part Description: 1A (0.05R Max DC Resistance) Zero Ohm Jumper; Manufacturer: GENERIC; Manufacturer1 Part Number: 232270591001L; PressFit: No; Part Number: R0402_0R_JUMPER; Component Kind: Standard; Component Type: Standard; Pin Count: 2; Value: 0; Status: Not Recommended; Manufacturer Part Number: R0402_0R_JUMPER; Case: 0402; Mounted: Yes; Sense: No; Socket: No; SMD: Yes; Manufacturer1 Example: YAGEO PHYCOMP; Manufacturer1 ComponentHeight: 0.4mm; HelpURL: \\cern.ch\dfs\Applications\Altium\Datasheets\R0402_Phycomp_RC0402.pdf; Author: CERN DEM JLC; CreateDate: 03.12.2007; LatestRevisionDate: 17.10.2012
R101 R102 = R0402_6K2_1%_0.0625W_100PPM: Resistor - 1%; Part Description: General Purpose Thick Film Chip Resistor; Manufacturer: GENERIC; Manufacturer1 Part Number: 232270676202L; TC: ±100ppm/°C; PressFit: No; Part Number: R0402_6K2_1%_0.0625W_100PPM; Component Kind: Standard; Component Type: Standard; Pin Count: 2; Value: 6k2; Status: Not Recommended; Power: 0.0625W; Manufacturer Part Number: R0402_6K2_1%_0.0625W_100PPM; Case: 0402; Mounted: Yes; Sense: No; Socket: No; SMD: Yes; Manufacturer1 Example: YAGEO PHYCOMP; Manufacturer1 ComponentHeight: 0.4mm; HelpURL: \\cern.ch\dfs\Applications\Altium\Datasheets\R0402_Phycomp_RC0402.pdf; Author: CERN DEM JLC; CreateDate: 03.12.2007; LatestRevisionDate: 17.10.2012
R106 = R0402_12K_1%_0.0625W_100PPM: Resistor - 1%; Part Description: General Purpose Thick Film Chip Resistor; Manufacturer: GENERIC; Manufacturer1 Part Number: 232270671203L; TC: ±100ppm/°C; PressFit: No; Part Number: R0402_12K_1%_0.0625W_100PPM; Component Kind: Standard; Component Type: Standard; Pin Count: 2; Value: 12k; Status: Not Recommended; Power: 0.0625W; Manufacturer Part Number: R0402_12K_1%_0.0625W_100PPM; Case: 0402; Mounted: Yes; Sense: No; Socket: No; SMD: Yes; Manufacturer1 Example: YAGEO PHYCOMP; Manufacturer1 ComponentHeight: 0.4mm; HelpURL: \\cern.ch\dfs\Applications\Altium\Datasheets\R0402_Phycomp_RC0402.pdf; Author: CERN DEM JLC; CreateDate: 03.12.2007; LatestRevisionDate: 17.10.2012

## Sheet HP_LASER_PS.SchDoc: AI ARTIQ Driver
size 420 x 297 mm; Author: G.Kasprowicz; CompanyName: CTI; Organization: CTI; Address1: CTI; Address2: Nowowiejska 15/19 00-665 Warsaw; Address3: gkasprow@gmail.com; DocumentNumber: 10; Revision: 1.0; SheetNumber: 10; SheetTotal: 11; ModifiedBy: -; CheckedDate: -; Title2: HP LASER PS; DivGrp: CTI; ModifiedDate: -; ProjectName: Sensor Box
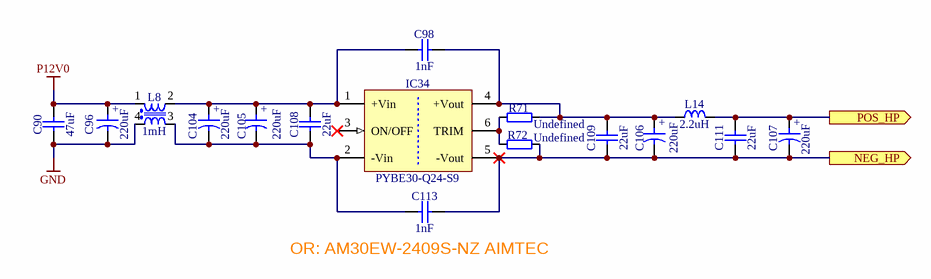
[diagram p8: HP_LASER_PS.SchDoc]

### Parts
C90  47uF  [CAPC3225X270N]
C96  220uF  [CAPAE830X1020N]
C98  1nF  [CAPC3216X180N]
C104  220uF  [CAPAE830X1020N]
C105  220uF  [CAPAE830X1020N]
C106  220uF  [CAPAE830X1020N]
C107  220uF  [CAPAE830X1020N]
C108  22uF  [CAPC3216X180N]
C109  22uF  [CAPC3216X180N]
C111  22uF  [CAPC3216X180N]
C113  1nF  [CAPC3216X180N]
IC34  PYBE30-Q24-S9  [DCDC_TRACO_TEN30]
L8  1mH  [IND_WURTH_WE-CMB-XS]
L14  2.2uH  [IND_BOURNS_SRR1260]
R71  Undefined  [RESC1608X55N]
R72  Undefined  [RESC1608X55N]

### Ports
NEG_HP (out), POS_HP (out)

### Nets
GND: C90.1 C96.2 L8.4
P12V0: C90.2 C96.1 L8.1
NetC98_1: C98.1 C104.1 C105.1 C108.2 IC34.1(+Vin) L8.2
NetC98_2: C98.2 C106.1 C109.2 IC34.4(+Vout) L14.1 R71.1
NetC104_2: C104.2 C105.2 C108.1 C113.1 IC34.2(-Vin) L8.3
NetC106_2: C106.2 C107.2 C109.1 C111.1 C113.2 IC34.5(-Vout) R72.1 ; port NEG_HP
NetC107_1: C107.1 C111.2 L14.2 ; port POS_HP
NetIC34_6: IC34.6(TRIM) R71.2 R72.2

Not connected (* = marked no-connect by the designer): IC34 3(ON/OFF)*

### Notes on the sheet
- (near C113) OR: AM30EW-2409S-NZ AIMTEC
- Project/Equipment
- Document
- Designer
- Drawn by
- Check.by
- Copyright 2018.
  This documentation describes Open Hardware and is licensed under the CERN OHL v.1.1. You may redistribute and modify this documentation under the terms of the CERN OHL v.1.1. (http://ohwr.org/CERNOHL). This documentation is distributed WITHOUT ANY EXPRESS OR IMPLIED WARRANTY, INCLUDING OF MERCHANTABILITY, SATISFACTORY QUALITY AND FITNESS FOR A PARTICULAR PURPOSE. Please see the CERN OHL v.1.1 for applicable conditions.
- Contact
- File
- Last Mod.
- Print Date
- Sheet
- Size
- A3
- of
- Rev
- (in symbol CAE830-1020_220UF_25V_20%) +

### Library data of the parts
C90 = CC1210_47UF_16V_20%_X5R: Non-polarised capacitor; Part Description: SMD Multilayer Chip Ceramic Capacitor; Manufacturer: GENERIC; Manufacturer1 Part Number: EMK325BJ476MM-T; Voltage: 16V; TC: X5R; Tolerance: ±20%; Part Number: CC1210_47UF_16V_20%_X5R; Component Kind: Standard; Component Type: Standard; Pin Count: 2; Value: 47uF; Status: None; Manufacturer Part Number: CC1210_47UF_16V_20%_X5R; Case: 1210; Mounted: Yes; Socket: No; SMD: Yes; Sense: No; Manufacturer1 Example: TAIYO YUDEN; Manufacturer1 ComponentHeight: 2.7mm; HelpURL: \\cern.ch\dfs\Applications\Altium\Datasheets\CC1210_X5R_TAIYO-YUDEN_HIGH-VALUE.pdf; Author: CERN DEM MR; CreateDate: 03.02.2016; LatestRevisionDate: 03.02.2016
C96 C104-C107 = CAE830-1020_220UF_25V_20%: Polarised capacitor; Part Description: Aluminum Electrolytic SMT Capacitor; Manufacturer: PANASONIC; Manufacturer Part Number: EEEFK1E221AP; Voltage: 25V; Tolerance: ±20%; Part Number: CAE830-1020_220UF_25V_20%; Component Kind: Standard; Component Type: Standard; Pin Count: 2; Value: 220uF; Status: Not Recommended; Case: F; Mounted: Yes; Socket: No; SMD: Yes; Sense: No; ComponentHeight: 10.2mm; HelpURL: \\cern.ch\dfs\Applications\Altium\Datasheets\CAE_PANASONIC_FK.pdf; Author: CERN DEM JLC; CreateDate: 03.12.2007; LatestRevisionDate: 05.11.2014
C98 C113 = CC1206_1NF_2KV_10%_X7R: Non-polarised capacitor; Part Description: High Voltage MLC Chip Capacitor; Manufacturer: GENERIC; Manufacturer1 Part Number: 1206GC102KAT2A; Voltage: 2kV; TC: X7R; Tolerance: ±10%; Part Number: CC1206_1NF_2KV_10%_X7R; Component Kind: Standard; Component Type: Standard; Pin Count: 2; Value: 1nF; Status: None; Manufacturer Part Number: CC1206_1NF_2KV_10%_X7R; Case: 1206; Mounted: Yes; Socket: No; SMD: Yes; Sense: No; Manufacturer1 Example: AVX; Manufacturer1 ComponentHeight: 1.8mm; HelpURL: \\cern.ch\dfs\Applications\Altium\Datasheets\CC1206_X7R_AVX_HV-MLC.pdf; Author: CERN DEM JLC; CreateDate: 19.11.2012; LatestRevisionDate: 17.05.2017
C108 C109 C111 = CC1206_22UF_35V_20%_JB_TDK_C3216JB1V226M160AC: as C1 on sheet LN_LASER_PS; Part Number: CC1206_22UF_35V_20%_JB_TDK_C3216JB1V226M160AC; Component Kind: Standard; Component Type: Standard; Pin Count: 2; Value: 22uF; Status: None; Manufacturer Part Number: C3216JB1V226M160AC; Case: 1206; Mounted: Yes; Socket: No; SMD: Yes; Sense: No; ComponentHeight: 1.8mm; HelpURL: \\cern.ch\dfs\Applications\Altium\Datasheets\CC1206_TDK_C3216JB1V226M160AC.pdf; Author: CERN DEM JLC; CreateDate: 13.07.2017; LatestRevisionDate: 13.07.2017
IC34 = TEN 30-2413: TRACO, TEN30 Series, Single Output DCDC Converter; Part Description: 18-36VDC to 15VDC, Iout (max) 2.0A, 30W DC-DC Converter; Manufacturer: CUI; PressFit: No; Bonding: No; Part Number: PYBE30-Q24-S9; Component Kind: Standard; Component Type: Standard; Device: PYBE30-Q24-S9; PackageDescription: TEN 30 Series, Body 51.3x25.9mm; Manufacturer Part Number: PYBE30-Q24-S9; Pin Count: 6; Mounted: Yes; Socket: No; SMD: No; Sense: No; ComponentHeight: 10.7mm; HelpURL: \\cern.ch\dfs\Applications\Altium\Datasheets\TEN 30-2413.pdf; Author: CERN DEM JMW; CreateDate: 07.06.2011; LatestRevisionDate: 06.01.2011
L8 = IND_1MH_30%_WURTH_WE-CMB-XS: Inductor Common Mode; Part Description: Common Mode Power Choke WE-CMB Series Type XS; Manufacturer: WURTH ELEKTRONIK; Manufacturer Part Number: 744821201; Power: 2A; Resistance: 0.045R; Tolerance: ±30%; Part Number: IND_1MH_30%_WURTH_WE-CMB-XS; Component Kind: Standard; Component Type: Standard; Pin Count: 4; Value: 1mH; Mounted: Yes; Socket: No; SMD: No; Sense: No; ComponentHeight: 18mm; HelpURL: \\cern.ch\dfs\Applications\Altium\Datasheets\IND_WURTH_WE-CMB_744821201.pdf; Author: CERN DEM JLC; CreateDate: 03.09.2012; LatestRevisionDate: 03.09.2012
L14 = IND_2.2UH_30%_BOURNS_SRR1260: Inductor; Part Description: Shielded SMD Power Inductor; Manufacturer: BOURNS; Manufacturer Part Number: SRR1260-2R2Y; Power: 8.2A; Resistance: 0.0105R; Tolerance: ±30%; Part Number: IND_2.2UH_30%_BOURNS_SRR1260; Component Kind: Standard; Component Type: Standard; Pin Count: 2; Value: 2.2uH; Status: None; Mounted: Yes; Socket: No; SMD: Yes; Sense: No; ComponentHeight: 6.5mm; HelpURL: \\cern.ch\dfs\Applications\Altium\Datasheets\IND_BOURNS_SRR1260.pdf; Author: CERN DEM JLC; CreateDate: 30.08.2010; LatestRevisionDate: 30.08.2010
R71 R72 = R0603_NO-VALUE: Resistor; Part Description: Reserved Footprint For a 0603 (1608) Chip Resistor; PressFit: No; Mounted: No; Part Number: R0603_NO-VALUE; Component Kind: Standard; Component Type: Standard; Pin Count: 2; Value: Undefined; Status: None; Manufacturer: Undefined; Manufacturer Part Number: R0603_NO-VALUE; Case: 0603; Sense: No; Socket: No; SMD: Yes; Manufacturer1 Example: Undefined; Manufacturer1 Part Number: Undefined; Manufacturer1 ComponentHeight: Undefined; HelpURL: Undefined; Author: CERN DEM JLC; CreateDate: 03.12.2007; LatestRevisionDate: 13.03.2008